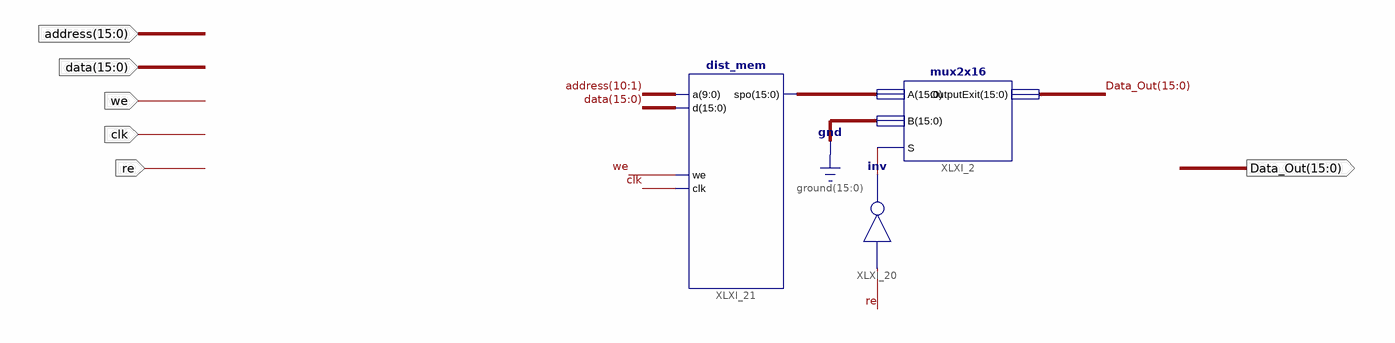
[diagram p0: schematic sheet 1]
// Xilinx ISE schematic Memory.sch (spartan3e) as structural Verilog: 3 symbols, 7 ports
module Memory (
  input  [15:0] address,
  input  [15:0] data,
  input  we,
  input  clk,
  input  re,
  output [15:0] Data_Out
);

  wire XLXN_61;
  wire [15:0] XLXN_22;

  mux2x16 XLXI_2 (.A(XLXN_22), .B({16{1'b0}}), .S(XLXN_61), .OutputExit(Data_Out));
  not XLXI_20 (XLXN_61, re);
  dist_mem XLXI_21 (.a(address[10:1]), .d(data), .we(we), .clk(clk), .spo(XLXN_22));
endmodule
